# Altium project TIDA-010933-RevA.PrjPcb (part 6 of 8)
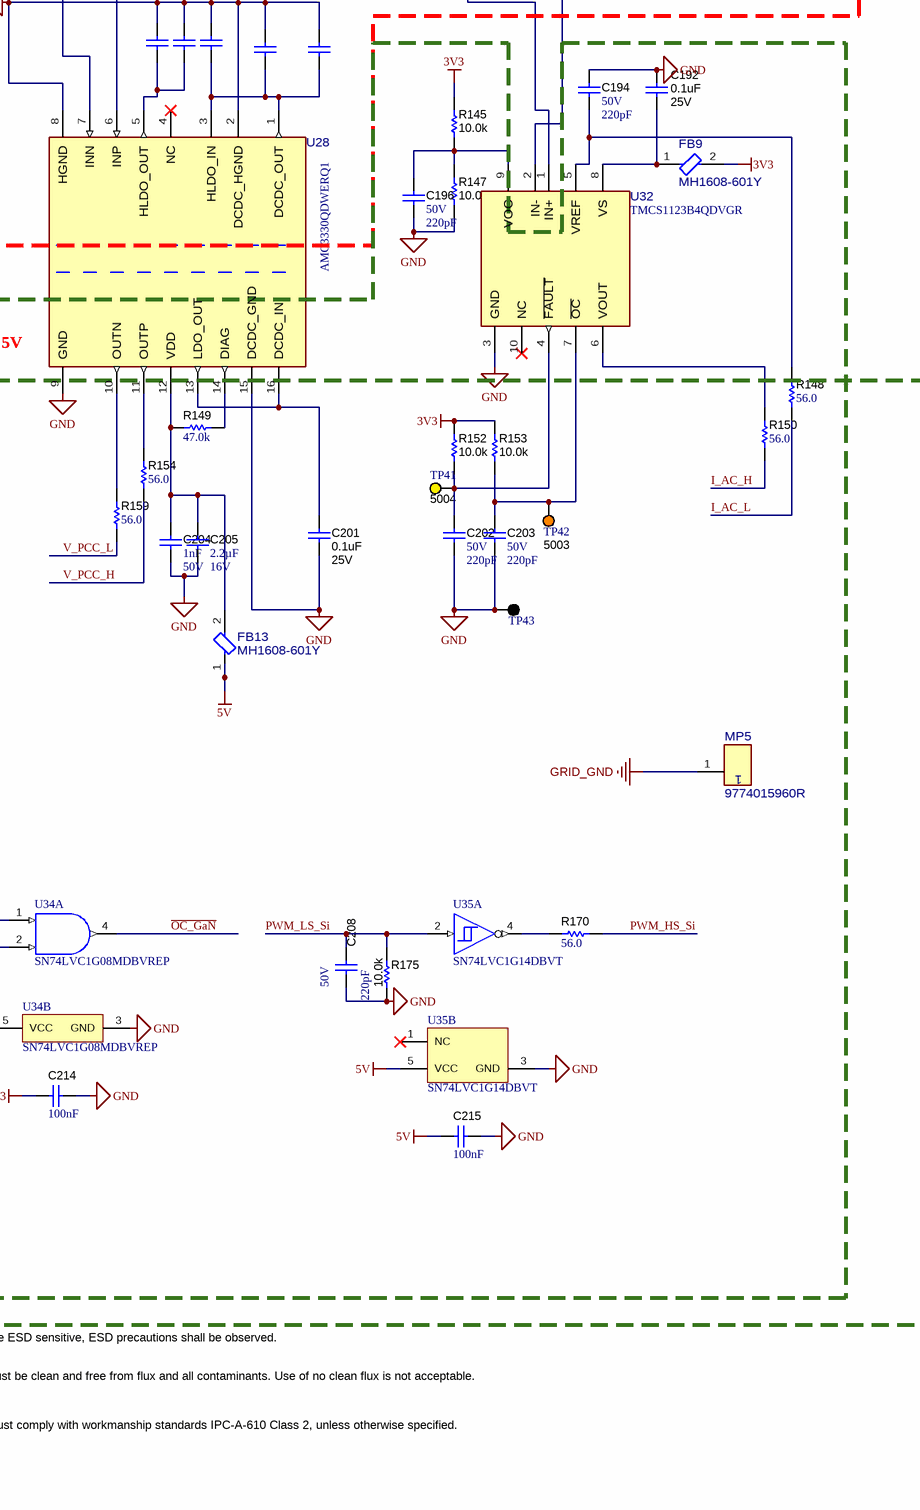
[diagram p111: TIDA-010933-DCAC-TOP.SchDoc, bottom right]

## Sheet TIDA-010933-DCAC-TOP.SchDoc (continued)

### Library data of the parts
!PCB1 = CMP-0003618-2: Manufacturer: Any; PartNumber: TIDA-010933; CompType: PCB; RoHS: O; MountType: N/A; Publisher: Texas Instruments; LatestRevisionDate: 2017-03-09; Key: PCB
C167-C170 = CMP-0009613-2: CAP, CERM, 2200 pF, 300 V, +/- 20%, E, TH, 2- Leads, Body 9x7mm, Pin Spacing 7.5mm; Manufacturer: MuRata; TaMin_C: -40°C; Polarized: N; SizeAreaWB_mm2: 99; Value1: Unknown; U/M: EA; Value: 2200pF; TaMax_C: 125°C; SizeZ_mm: 12; SizeX_mm: 9; SizeY_mm: 7; Cap_Case: 9x7x9mm; SizeArea_mm2: 63; Cap_F: 2.2nF; AEC Category: Q200; Supplier Part Number 2: 81-DE6E3KJ222MN3A; Publisher: Texas Instruments; Supplier 2: Mouser; TempCo: E; Published: 2008-06-19; RoHS: Y; MountType: TH; Supplier 1: Digi-Key; PackageReference: TH, 2- Leads, Body 9x7mm, Pin Spacing 7.5mm; Tolerance_%: 20%; Value2: 300V; CompType: Capacitor; LatestRevisionDate: 2017-03-09; PartNumber: DE6E3KJ222MN3A; AEC Qualified: ?; ComponentLink1Description: Datasheet link; Supplier Part Number 1: DE6E3KJ222MN3A-ND; Technology: Ceramic; ComponentLink1URL: http://psearch.murata.com/capacitor/product/DE6E3KJ222MN3A.pdf
C171 C172 = CMP-0094225-1: 5.6 µF Film Capacitor - 600V Polypropylene (PP), Metallized Radial; Manufacturer: KEMET; Standoff Height: 0.5mm; SizeZ_mm: 25.2mm; AEC Qualified: Yes; Cap_F: 5.6µF; Tolerance_%: 5%; AEC Grade: Grade 1; Value: 5.6µF; Lead Free: Yes; Datasheet Path: datasheets/Cap-C4AQHBU4560P1XJ.pdf; ComponentLink1URL: https://content.kemet.com/datasheets/KEM_F3128_C4AQ_P.pdf; PartNumber: C4AQHBU4560P1XJ; Digikey Description: CAP FILM 5.6UF 5% 600VDC RADIAL; Supplier 1: Digikey; Supplier Part Number 1: 399-C4AQHBU4560P1XJ-ND; datasheet: https://content.kemet.com/datasheets/KEM_F3128_C4AQ_P.pdf; Part Number: C4AQHBU4560P1XJ; helpURL: https://upverter.com/upn/revision/c563b483adbcab9e/; PackageReference: RADIAL; ComponentLink1Description: Datasheet; Supplier 2: Mouser; Mouser Part Number: 80-C4AQHBU4560P1XJ; Operating Temperature Range: -55°C to +125°C; Supplier Part Number 2: 80-C4AQHBU4560P1XJ; Digikey Part Number: 399-C4AQHBU4560P1XJ-ND; RoHS: TRUE
C173 C175 C179 = CMP-0038374-1: ALC80, Aluminum Electrolytic, 120 uF, 20%, 450 VDC, -40/+105°C; Manufacturer: KEMET; AEC Qualified: No; Cap_F: 120µF; IRMS_A: 3.13A; SizeZ_mm: 42mm; Esr: 1.075; Leakage Current: 162uA; Life: 6000Hours; Value: 120µF; PackageReference: RADIAL; PartNumber: ALC80A121BD450; RoHS: TRUE; Tolerance_%: 20%; Part Number: ALC80A121BD450; datasheet: https://content.kemet.com/datasheets/KEM_A4082_ALC80.pdf; Datasheet Path: datasheets/Cap-ALC80A121BD450.pdf; helpURL: https://upverter.com/upn/revision/7d670a938a867c59/; Lead Free: Yes; Operating Temperature Range: -40°C to +105°C; ComponentLink1Description: Datasheet; ComponentLink1URL: https://content.kemet.com/datasheets/KEM_A4082_ALC80.pdf
C174 C178 C180 C181 = CMP-0009326-2: CAP, CERM, 0.1 uF, 1000 V, +/- 10%, X7R, 1812; Manufacturer: Kemet; Polarized: N; Value: 0.1uF; U/M: EA; Cap_F: 100nF; Value1: Unknown; VDC_V: 1kV; Value2: 1000V; TaMin_C: -55°C; TaMax_C: 125°C; Cap_Case: 1812; AEC Category: Q200; SizeArea_mm2: 14.4; SizeAreaWB_mm2: 23.1; SizeX_mm: 4.5; SizeY_mm: 3.2; SizeZ_mm: 2.54; CompType: Capacitor; PartNumber: C1812W104KDRACTU; PackageReference: 1812; RoHS: Y; Tolerance_%: 10%; MountType: SMT; Technology: Ceramic; TempCo: X7R; Published: 2008-06-19; Publisher: Texas Instruments; LatestRevisionDate: 2017-03-09; ComponentLink1Description: Datasheet link; ComponentLink1URL: http://www.kemet.com/Lists/ProductCatalog/Attachments/122/KEM_C1034_X7R_HV_ARC_SMD.pdf; Supplier 1: Digi-Key; Supplier Part Number 1: 399-6523-1-ND; Supplier 2: Newark; Supplier Part Number 2: 93T1500; Supplier 3: Mouser; Supplier Part Number 3: 80-C1812W104KDR; AEC Qualified: N; AEC Grade: N/A
C176 = CMP-0037952-1: 2.2 µF Film Capacitor 310V Polypropylene (PP), Metallized Radial; Manufacturer: KEMET; AEC Grade: Grade 2; AEC Qualified: Yes; Cap_F: 2.2µF; SizeZ_mm: 25.1mm; Tolerance_%: 10%; VAC_X: X2; Value: 2.2µF; PackageReference: RADIAL; PartNumber: F863FL225K310Z; RoHS: TRUE; Supplier 1: Digikey; Supplier 2: Mouser; Supplier Part Number 1: 399-14811-ND; Supplier Part Number 2: 80-F863FL225K310Z; VAC: 310V; Part Number: F863FL225K310Z; datasheet: https://content.kemet.com/datasheets/KEM_F3110_F863_X2_310.pdf; Datasheet Path: datasheets/Cap-F863FL225K310Z.pdf; Digikey Description: CAP FILM 2.2UF 10% 310VAC RADIAL; Digikey Part Number: 399-14811-ND; helpURL: https://upverter.com/upn/revision/6037da2ac259c91a/; Lead Free: Yes; Mouser Part Number: 80-F863FL225K310Z; Operating Temperature Range: -40°C to +110°C; Voltage Ac Rating X: 310V; ComponentLink1Description: Datasheet; ComponentLink1URL: https://content.kemet.com/datasheets/KEM_F3110_F863_X2_310.pdf
C177 = CMP-0037951-1: Cap Film 1uF 310VAC PP 10% (26.5 X 11 X 20mm) Dipped Radial 22.5mm 110°C Pizza Pack; Manufacturer: KEMET; AEC Grade: Grade 1; AEC Qualified: Yes; Cap_F: 1µF; SizeZ_mm: 20.1mm; VAC: 310V; VAC_X: X2; Value: 1µF; PackageReference: RADIAL; PartNumber: F863DS105K310Z; RoHS: TRUE; Supplier 1: Digikey; Supplier 2: Mouser; Supplier Part Number 1: 399-14809-ND; Supplier Part Number 2: 80-F863DS105K310Z; Tolerance_%: 10%; Part Number: F863DS105K310Z; datasheet: https://content.kemet.com/datasheets/KEM_F3110_F863_X2_310.pdf; Datasheet Path: datasheets/Cap-F863DS105K310Z.pdf; Digikey Description: CAP FILM 1UF 10% 310VAC RADIAL; Digikey Part Number: 399-14809-ND; helpURL: https://upverter.com/upn/revision/10eff80190826337/; Lead Free: Yes; Mouser Part Number: 80-F863DS105K310Z; Operating Temperature Range: -40°C to +110°C; Voltage Ac Rating X: 310V; ComponentLink1Description: Datasheet; ComponentLink1URL: https://content.kemet.com/datasheets/KEM_F3110_F863_X2_310.pdf
C182 C184 = CMP-0007238-4: CAP, CERM, 1000 pF, 100 V, +/- 5%, C0G/NP0, 0603; Manufacturer: MuRata; TaMin_C: -55°C; Polarized: N; SizeAreaWB_mm2: 4.68; Value1: Unknown; U/M: EA; Value: 1000pF; TaMax_C: 125°C; SizeZ_mm: 1; SizeX_mm: 1.6; SizeY_mm: 0.8; SizeArea_mm2: 1.28; Cap_F: 1nF; AEC Category: Q200; Supplier Part Number 2: 81-GRM1885C2A102JA01; Publisher: Texas Instruments; Supplier 2: Mouser; TempCo: C0G/NP0; Published: 2008-06-19; RoHS: Y; MountType: SMT; Supplier 1: Digi-Key; PackageReference: 0603; Tolerance_%: 5%; Cap_Case: 0603; Value2: 100V; CompType: Capacitor; LatestRevisionDate: 2017-03-09; PartNumber: GRM1885C2A102JA01D; AEC Qualified: ?; ComponentLink1Description: Datasheet link; Supplier Part Number 1: 490-3281-1-ND; Technology: Ceramic; ComponentLink1URL: http://search.murata.co.jp/Ceramy/PnsearchViewAction.do?HnOFG=ON&HnNFG=ON&SEL_CNT=50&sLang=en&sKey=GRM1885C2A102JA01D&x=9&y=9&search=startwith
C183 C190 = CMP-0007082-4: CAP, CERM, 0.01 uF, 100 V, +/- 10%, X7R, AEC-Q200 Grade 1, 0603; Manufacturer: TDK; TaMin_C: -55°C; ESR_ohm: 2.35428d; Polarized: N; SizeAreaWB_mm2: 4.68; Value1: 0.235428 ohm; U/M: EA; Value: 0.01uF; TaMax_C: 125°C; SizeZ_mm: 1; SizeX_mm: 1.6; SizeY_mm: 0.8; SizeArea_mm2: 1.28; AEC Qualified: Y; IRMS_A: 3.96995dA; AEC Category: Q200; Supplier Part Number 2: 810-CGA3E2X7R2A103K080AA; Publisher: Texas Instruments; Supplier 2: Mouser; TempCo: X7R; Published: 2008-06-19; RoHS: Y; MountType: SMT; Supplier 1: Digi-Key; PackageReference: 0603; Tolerance_%: 10%; Cap_Case: 0603; Value2: 100V; CompType: Capacitor; LatestRevisionDate: 2017-03-09; PartNumber: CGA3E2X7R2A103K080AA; ComponentLink1Description: Datasheet link; AEC Grade: 1; Supplier Part Number 1: 445-5812-1-ND; Technology: Ceramic; ValueDisplayed: 0.01uF; ComponentLink1URL: https://product.tdk.com/en/search/capacitor/ceramic/mlcc/info?part_no=CGA3E2X7R2A103K080AA
C185 C188 C204 = CMP-0006976-1: CAP, CERM, 1000 pF, 50 V, +/- 10%, X7R, 0603; Manufacturer: Kemet; TaMin_C: -55°C; Polarized: N; SizeAreaWB_mm2: 4.68; Value1: Unknown; U/M: EA; Value: 1000pF; TaMax_C: 125°C; SizeZ_mm: 1; SizeX_mm: 1.6; SizeY_mm: 0.8; SizeArea_mm2: 1.28; AEC Category: Q200; ComponentLink1URL: http://www.kemet.com/kemet/web/homepage/kechome.nsf/vapubfiles/F3102_Y5V.pdf/$file/F3102_Y5V.pdf; Supplier Part Number 2: 80-C0603X102K5R; Publisher: Texas Instruments; Supplier 2: Mouser; Supplier Part Number 3: 1414025; TempCo: X7R; Supplier 3: Farnell; Published: 2008-06-19; RoHS: Y; MountType: SMT; Supplier 1: Digi-Key; PackageReference: 0603; Tolerance_%: 10%; Cap_Case: 0603; Value2: 50V; CompType: Capacitor; LatestRevisionDate: 2017-03-09; PartNumber: C0603X102K5RACTU; AEC Qualified: ?; ComponentLink1Description: Datasheet link; Supplier Part Number 1: 399-5348-1-ND; Technology: Ceramic; ValueDisplayed: 1000pF
C186 C187 C192 C201 = CMP-0006979-5: CAP, CERM, 0.1 uF, 25 V, +/- 10%, X7R, 0603; Manufacturer: Kemet; Polarized: N; Value: 0.1uF; U/M: EA; Cap_F: 100nF; Value1: Unknown; TaMin_C: -55°C; TaMax_C: 125°C; AEC Category: Q200; SizeArea_mm2: 1.28; SizeAreaWB_mm2: 4.68; SizeX_mm: 1.6; SizeY_mm: 0.8; SizeZ_mm: 1; CompType: Capacitor; PartNumber: C0603X104K3RACTU; PackageReference: 0603; RoHS: Y; Tolerance_%: 10%; Value2: 25V; MountType: SMT; Technology: Ceramic; TempCo: X7R; Cap_Case: 0603; Published: 2008-06-19; Publisher: Texas Instruments; LatestRevisionDate: 2017-03-09; ComponentLink1Description: Datasheet link; ComponentLink1URL: http://www.kemet.com/kemet/web/homepage/kechome.nsf/vapubfiles/F3102_Y5V.pdf/$file/F3102_Y5V.pdf; Supplier 1: Digi-Key; Supplier Part Number 1: 399-5345-1-ND; Supplier 2: Mouser; Supplier Part Number 2: 80-C0603X104K3R; Supplier 3: Farnell; Supplier Part Number 3: 1601773; AEC Qualified: ?
C189 C205 = CMP-0007121-4: CAP, CERM, 2.2 uF, 16 V, +/- 10%, X7R, 0603; Manufacturer: Taiyo Yuden; TaMin_C: -55°C; Polarized: N; SizeAreaWB_mm2: 4.68; Value1: Unknown; U/M: EA; Value: 2.2uF; TaMax_C: 125°C; SizeZ_mm: 1; SizeX_mm: 1.6; SizeY_mm: 0.8; SizeArea_mm2: 1.28; AEC Category: Q200; Supplier Part Number 2: 68X1300; Publisher: Texas Instruments; Supplier 2: Newark; Supplier Part Number 3: 963-EMK107BB7225KA-T; TempCo: X7R; Supplier 3: Mouser; Published: 2008-06-19; RoHS: Y; MountType: SMT; Supplier 1: Digi-Key; PackageReference: 0603; Tolerance_%: 10%; Cap_Case: 0603; Value2: 16V; CompType: Capacitor; LatestRevisionDate: 2017-03-09; PartNumber: EMK107BB7225KA-T; AEC Qualified: N; ComponentLink1Description: Datasheet link; AEC Grade: N/A; Supplier Part Number 1: EMK107BB7225KA-T-ND; Technology: Ceramic; ValueDisplayed: 2.2uF; ComponentLink1URL: http://www.yuden.co.jp/productdata/catalog/en/mlcc_all_e.pdf
C191 C193 C195 C197-C199 C206 C213-C215 = CMP-0006752-5: CAP, CERM, 0.1 uF, 25 V, +/- 5%, X7R, 0603; Manufacturer: AVX; TaMin_C: -55°C; ESR_ohm: 0.05; Polarized: N; SizeAreaWB_mm2: 4.68; Value1: 0.05 ohm; U/M: EA; Value: 0.1uF; TaMax_C: 125°C; SizeZ_mm: 1; SizeX_mm: 1.6; SizeY_mm: 0.8; Value2: 25V; SizeArea_mm2: 1.28; AEC Category: Q200; Supplier Part Number 2: 581-06033C104JAT2A; Publisher: Texas Instruments; Supplier 2: Mouser; Supplier Part Number 3: 1740614; TempCo: X7R; Supplier 3: Farnell; Published: 2008-06-19; RoHS: Y; MountType: SMT; Supplier 1: Digi-Key; PackageReference: 0603; Tolerance_%: 5%; Cap_Case: 0603; CompType: Capacitor; LatestRevisionDate: 2017-03-09; PartNumber: 06033C104JAT2A; AEC Qualified: N; VDC_V: 25V; ComponentLink1Description: Datasheet link; AEC Grade: N/A; Supplier Part Number 1: 478-3713-1-ND; Technology: Ceramic; ValueDisplayed: 0.1uF; ComponentLink1URL: http://datasheets.avx.com/X7RDielectric.pdf
C194 C196 C202 C203 C208-C212 C216 C217 = CMP-0006894-4: CAP, CERM, 220 pF, 50 V, +/- 10%, C0G/NP0, 0603; Manufacturer: Kemet; TaMin_C: -55°C; Polarized: N; SizeAreaWB_mm2: 4.68; Value1: Unknown; U/M: EA; Value: 220pF; TaMax_C: 125°C; SizeZ_mm: 1; SizeX_mm: 1.6; SizeY_mm: 0.8; SizeArea_mm2: 1.28; AEC Category: Q200; Supplier Part Number 2: 80-C0603C221K5G; Publisher: Texas Instruments; Supplier 2: Mouser; Supplier Part Number 3: 1167797; TempCo: C0G/NP0; Supplier 3: Farnell; Published: 2008-06-19; RoHS: Y; MountType: SMT; Supplier 1: Digi-Key; PackageReference: 0603; Tolerance_%: 10%; Cap_Case: 0603; Value2: 50V; CompType: Capacitor; LatestRevisionDate: 2017-03-09; PartNumber: C0603C221K5GACTU; AEC Qualified: ?; Cap_F: 220pF; ComponentLink1Description: Datasheet link; Supplier Part Number 1: 399-1065-1-ND; Technology: Ceramic; ComponentLink1URL: http://www.kemet.com/kemet/web/homepage/kechome.nsf/vapubfiles/F3102_Y5V.pdf/$file/F3102_Y5V.pdf
C200 = CMP-0006844-4: CAP, CERM, 1000 pF, 50 V, +/- 5%, X7R, AEC-Q200 Grade 1, 0603; Manufacturer: Kemet; TaMin_C: -55°C; Polarized: N; SizeAreaWB_mm2: 4.68; Value1: Unknown; U/M: EA; Value: 1000pF; TaMax_C: 125°C; SizeZ_mm: 1; SizeX_mm: 1.6; SizeY_mm: 0.8; SizeArea_mm2: 1.28; AEC Qualified: Y; AEC Category: Q200; Publisher: Texas Instruments; Supplier 2: Newark; Supplier Part Number 3: 80-C0603C102J5RAUTO; TempCo: X7R; Supplier 3: Mouser; Published: 2008-06-19; RoHS: Y; MountType: SMT; Supplier 1: Digi-Key; PackageReference: 0603; Tolerance_%: 5%; Cap_Case: 0603; Value2: 50V; CompType: Capacitor; LatestRevisionDate: 2017-03-09; PartNumber: C0603C102J5RACAUTO; ComponentLink1Description: Datasheet link; AEC Grade: 1; Supplier Part Number 1: 399-12989-1-ND; Technology: Ceramic; ValueDisplayed: 1000pF; ComponentLink1URL: http://www.kemet.com/docfinder?Partnumber=C0603C102J5RACAUTO
C207 = CMP-0011981-2: CAP, TA, 470 uF, 10 V, +/- 20%, 0.045 ohm, SMD; Manufacturer: AVX; TaMin_C: -55°C; ESR_ohm: 0.045; Polarized: Y; SizeAreaWB_mm2: 58.59; U/M: EA; Value: 470uF; TaMax_C: 125°C; SizeZ_mm: 4.3; SizeX_mm: 7.3; Cap_Case: E; SizeArea_mm2: 31.39; CompType: Capacitor; Cap_F: 470µF; IRMS_A: 1.732A; AEC Category: Q200; Supplier Part Number 2: 75M2993; Publisher: Texas Instruments; Supplier 2: Newark; Supplier Part Number 3: 581-TPSE477M010R0045; Supplier 3: Mouser; RoHS: Y; Value1: 0.045 ohm; MountType: SMT; Supplier 1: Digi-Key; LatestRevisionNote: Updated supplier links; PackageReference: 7343-43; Tolerance_%: 20%; SizeY_mm: 4.3; Value2: 10V; LatestRevisionDate: 2017-03-09; PartNumber: TPSE477M010R0045; AEC Qualified: ?; Series: TPS; ComponentLink1Description: Datasheet link; Supplier Part Number 1: 478-4148-1-ND; Technology: TA; ComponentLink1URL: http://www.avx.com/docs/masterpubs/tantniob.pdf
C220 C221 = CMP-0007196-3: CAP, CERM, 22 pF, 50 V, +/- 5%, C0G/NP0, 0603; Manufacturer: MuRata; TaMin_C: -55°C; Polarized: N; SizeAreaWB_mm2: 4.68; Value1: Unknown; U/M: EA; Value: 22pF; TaMax_C: 125°C; SizeZ_mm: 1; SizeX_mm: 1.6; SizeY_mm: 0.8; Value2: 50V; SizeArea_mm2: 1.28; AEC Category: Q200; Supplier Part Number 2: 81-GRM39C220J50; Publisher: Texas Instruments; Supplier 2: Mouser; Supplier Part Number 3: 8819831; TempCo: C0G/NP0; Supplier 3: Farnell; Published: 2008-06-19; RoHS: Y; MountType: SMT; Supplier 1: Digi-Key; PackageReference: 0603; Tolerance_%: 5%; Cap_Case: 0603; CompType: Capacitor; LatestRevisionDate: 2017-03-09; PartNumber: GRM1885C1H220JA01D; AEC Qualified: ?; Cap_F: 22pF; VDC_V: 50V; ComponentLink1Description: Datasheet link; Supplier Part Number 1: 490-1411-1-ND; Technology: Ceramic; ComponentLink1URL: http://search.murata.co.jp/Ceramy/PnsearchViewAction.do?HnOFG=ON&HnNFG=ON&SEL_CNT=50&sLang=en&sKey=GRM1885C1H220JA01D&x=9&y=9&search=startwith
D32 = CMP-0028882-2: Diode, Schottky, 40 V, 0.75 A, AEC-Q101, SOD-323; Manufacturer: Infineon Technologies; SizeAreaWB_mm2: 8.695; SizeX_mm: 2.7; Value1: 0.75A; Value2: 0.74V; SizeArea_mm2: 3.645; Vr_V: 40V; SizeY_mm: 1.35; Io_A: 750mA; Green_REACh: Incomplete; Value: 40V; Vf_V: 740mV; AEC Qualified: Y; SizeZ_mm: 1; Green_Lifecycle: Not Set; AEC Category: Q101; TJmax_C: 150°C; RoHS: Y; ComponentLink1URL: http://www.infineon.com/dgdl/bat165series.pdf?folderId=db3a304313d846880113def5812204a1&fileId=db3a304313d846880113df01f69804d6; ComponentLink1Description: Datasheet link; Green_EU RoHS: Incomplete; Green_EU RoHS-2: Incomplete; Type: Schottky; CompType: Diode; MountType: SMT; PartNumber: BAT165E6327HTSA1; PackageReference: SOD-323
F1 F2 = CMP-0037653-1: 15 A 250 V AC 80 V DC Fuse Board Mount (Cartridge Style Excluded) Surface Mount 2-SMD, Square End Block; Manufacturer: Bourns; Interrupt_AC: 150A; Interrupt_DC: 300A; MeltingTyp: 141.75A2Sec; SizeZ_mm: 3.3mm; VAC_V: 250V; Fuse Speed: Fast; AEC Qualified: No; Fuse Current: 15A; Res_ohm: 0.005Ω; PackageReference: 3812; PartNumber: SF-3812F1500T-2; RoHS: TRUE; Supplier 1: Digikey; Supplier 2: Mouser; Supplier Part Number 1: SF-3812F1500T-2CT-ND; Supplier Part Number 2: 652-SF-3812F1500T-2; Part Number: SF-3812F1500T-2; datasheet: https://www.bourns.com/docs/Product-Datasheets/SF-3812F-T.pdf; Datasheet Path: datasheets/Fuse-SF-3812F1500T-2.pdf; Digikey Description: FUSE BRD MT 15A 250VAC/80DC 2SMD; Digikey Part Number: SF-3812F1500T-2CT-ND; Fuse I2T: 141.75A2Sec; Fuse Interrupt Dc Current: 300A; helpURL: https://upverter.com/upn/revision/1547e1d885071418/; Lead Free: Yes; Mouser Description: Fuse Chip Fast Acting 15A 250V SMD Solder Pad 3812 10.1 X 3.1mm Ceramic T/R; Mouser Part Number: 652-SF-3812F1500T-2; Operating Temperature Range: -55°C to +125°C; ComponentLink1Description: Datasheet; ComponentLink1URL: https://www.bourns.com/docs/Product-Datasheets/SF-3812F-T.pdf
FB6-FB13 = CMP-0037505-1: 600 Ohms @ 100 MHz 1 Power, Signal Line Ferrite Bead 0603 (1608 Metric) 1A 200mOhm; Manufacturer: Bourns; DCR_ohm: 0.2; SizeZ_mm: 1mm; AEC Qualified: No; Impedance At Frequency: 600Ω @ 100MHz; Test Frequency: 100MHz; Tolerance_%: 25%; Imax_A: 1A; PackageReference: 0603; PartNumber: MH1608-601Y; RoHS: TRUE; Supplier 1: Digikey; Supplier 2: Mouser; Supplier Part Number 1: MH1608-601YCT-ND; Supplier Part Number 2: 652-MH1608-601Y; Part Number: MH1608-601Y; datasheet: https://www.bourns.com/docs/Product-Datasheets/mh.pdf; Datasheet Path: datasheets/FBead-MH1608-601Y.pdf; Digikey Description: FERRITE BEAD 600 OHM 0603 1LN; Digikey Part Number: MH1608-601YCT-ND; helpURL: https://upverter.com/upn/revision/07c7dad827ccdff3/; Lead Free: Yes; Material: Ferrite; Mouser Description: Ferrite Beads 600 ohms 25% HIGH CURRENT; Mouser Part Number: 652-MH1608-601Y; Operating Temperature Range: -55°C to +125°C; Technology: Chip; ComponentLink1Description: Datasheet; ComponentLink1URL: https://www.bourns.com/docs/Product-Datasheets/mh.pdf
FID1-FID6 = CMP-0077181-1: Fiducial mark.  There is nothing to buy or mount.; CompType: Fiducial; Manufacturer: N/A; MountType: N/A; PackageReference: N/A; PartNumber: N/A; ClassName: FiducialMark; Library Reference: Fiducial
J9 = CMP-0094328-1: 3 Position Terminal Block Header, Male Pins, Shrouded (4 Side) 0.200" (5.08mm) Vertical - Through Hole; Manufacturer: TE Connectivity; Current_A: 15A; Row_Count: 1; AEC Qualified: No; Voltage_V: 300V; SizeZ_mm: 12.25mm; Min Wire Gauge: 30; ContactFinish: Tin; Max Wire Gauge: 12; Supplier Part Number 2: 571-796636-3; datasheet: https://www.te.com/commerce/DocumentDelivery/DDEController?Action=showdoc&DocId=Customer+Drawing%7F796636%7FC6%7Fpdf%7FEnglish%7FENG_CD_796636_C6.pdf%7F796636-3; Datasheet Path: datasheets/Conn-796636-3.pdf; PartNumber: 796636-3; ComponentLink1URL: https://www.te.com/commerce/DocumentDelivery/DDEController?Action=showdoc&DocId=Customer+Drawing%7F796636%7FC6%7Fpdf%7FEnglish%7FENG_CD_796636_C6.pdf%7F796636-3; Lead Free: Yes; ComponentLink1Description: Datasheet; Supplier 1: Digikey; Operating Temperature Range: -40°C to +105°C; helpURL: https://upverter.com/upn/revision/c1a9aec1f58481f7/; Digikey Description: TERM BLOCK HDR 3POS VERT 5.08MM; Supplier Part Number 1: A98423-ND; RoHS: TRUE; Mouser Description: Buchanan, Terminal Block Connector, PCB, Header, Single Row, 3 Position, 5.08 mm, Green; PinCount: 3; Part Number: 796636-3; Digikey Part Number: A98423-ND; Conn Orientation: Vertical; Conn Gender: Male; PackageReference: HDR3; Mouser Part Number: 571-796636-3; DUT-Pitch_mm: 5.08mm; Supplier 2: Mouser
J16 = CMP-0032022-2: Banana Jack Connector Standard Banana Solder Red; Manufacturer: CLIFF Electronic Components; ContactFinish: Gold; Current_A: 24A; Voltage_V: 1kV; AEC Qualified: No; Conn Orientation: Horizontal; Is Female: yes; SizeZ_mm: 12.5mm; Standoff Height: 0.7mm; PackageReference: CONN_BANANA_JACK; PartNumber: FCR7350R; PinCount: 1; RoHS: TRUE; Supplier 1: Digikey; Supplier Part Number 1: 4654-FCR7350R-ND; Part Number: FCR7350R; datasheet: https://www.farnell.com/datasheets/3216443.pdf; Datasheet Path: datasheets/Conn-FCR7350R.pdf; Digikey Description: 4MM PANEL SKT S16N-PC RED; Digikey Part Number: 4654-FCR7350R-ND; helpURL: https://upverter.com/upn/revision/ed2a00f5535e7036/; Lead Free: Yes; Operating Temperature Range: -40°C to +80°C; ComponentLink1Description: Datasheet; ComponentLink1URL: https://www.farnell.com/datasheets/3216443.pdf
J17 J19 = CMP-0032021-2: Banana Jack Connector Standard Banana Solder Black; Manufacturer: CLIFF Electronic Components; ContactFinish: Gold; Current_A: 24A; Voltage_V: 1kV; AEC Qualified: No; Conn Orientation: Horizontal; Is Female: yes; SizeZ_mm: 12.5mm; Standoff Height: 0.7mm; PackageReference: CONN_BANANA_JACK; PartNumber: FCR7350B; PinCount: 1; RoHS: TRUE; Supplier 1: Digikey; Supplier Part Number 1: 4654-FCR7350B-ND; Part Number: FCR7350B; datasheet: https://www.cliffuk.co.uk/products/testleads/sockets/fcr7350.pdf; Datasheet Path: datasheets/Conn-FCR7350B.pdf; Digikey Description: 4MM PANEL SKT S16N-PC BLACK; Digikey Part Number: 4654-FCR7350B-ND; helpURL: https://upverter.com/upn/revision/598fb79d4513ed1f/; Lead Free: Yes; Operating Temperature Range: -40°C to +80°C; ComponentLink1Description: Datasheet; ComponentLink1URL: https://www.cliffuk.co.uk/products/testleads/sockets/fcr7350.pdf
J18 = CMP-0032023-2: Banana Jack Connector Standard Banana Solder Yellow; Manufacturer: CLIFF Electronic Components; ContactFinish: Gold; Current_A: 24A; Voltage_V: 1kV; AEC Qualified: No; Conn Orientation: Horizontal; Is Female: yes; SizeZ_mm: 12.5mm; Standoff Height: 0.7mm; PackageReference: CONN_BANANA_JACK; PartNumber: FCR7350Y; PinCount: 1; RoHS: TRUE; Supplier 1: Digikey; Supplier Part Number 1: 4654-FCR7350Y-ND; Part Number: FCR7350Y; datasheet: https://www.farnell.com/datasheets/3216443.pdf; Datasheet Path: datasheets/Conn-FCR7350Y.pdf; Digikey Description: 4MM PANEL SKT S16N-PC YELLOW; Digikey Part Number: 4654-FCR7350Y-ND; helpURL: https://upverter.com/upn/revision/477f41296692cbd3/; Lead Free: Yes; Operating Temperature Range: -40°C to +80°C; ComponentLink1Description: Datasheet; ComponentLink1URL: https://www.farnell.com/datasheets/3216443.pdf
J20 = CMP-0098295-2: Banana Test Connector, 4mm, Socket, PCB Mount, 24 A, 1 kV, Gold Plated Contacts, Blue; Manufacturer: CLIFF Electronic Components; Current_A: 24A; Voltage_V: 1kV; AEC Qualified: No; Conn Orientation: Right Angle; SizeZ_mm: 11.6mm; Standoff Height: 0.7mm; ContactFinish: Gold; PackageReference: CONN_BANANA_JACK; PartNumber: FCR7350L; PinCount: 1; RoHS: TRUE; Part Number: FCR7350L; datasheet: https://www.cliffuk.co.uk/products/testleads/sockets/fcr7350.pdf; Datasheet Path: datasheets/Conn-FCR7350L.pdf; helpURL: https://upverter.com/upn/revision/8f9f2a5472dd5be9/; Lead Free: Yes; Operating Temperature Range: -40°C to +80°C; ComponentLink1Description: Datasheet; ComponentLink1URL: https://www.cliffuk.co.uk/products/testleads/sockets/fcr7350.pdf
K1 = CMP-0002638-2: Relay, SPDT (1 Form C), 16 A, 5 V, TH; Manufacturer: TE Connectivity; Contact Rating_A: 16A; Turn On Voltage (Max)_VDC: 3.5V; Coil Power_W: 403mW; Coil Resistance_ohm: 62; SizeAreaWB_mm2: 455.7; Time Operate (s): 8ms; Coil Current_A: 80.6mA; SizeZ_mm: 15.7; SizeX_mm: 12.7; SizeY_mm: 29; SizeArea_mm2: 368.3; Turn Off Voltage (Min)_VDC: 5dV; Coil Type: Non Latching; Time Release (s): 6ms; Coil Voltage_VDC: 5V; Supplier Part Number 2: 36K7603; Supplier 2: Newark; Supplier Part Number 3: 655-RTD14005F; Supplier 3: Mouser; RoHS: Y; MountType: TH; Supplier 1: Digi-Key; Contact Form: SPDT (1 Form C); PackageReference: 29 x 12.7 mm; PartNumber: RTD14005F; ComponentLink1Description: Datasheet URL; Supplier Part Number 1: PB291-ND; ComponentLink1URL: http://www.te.com/commerce/DocumentDelivery/DDEController?Action=srchrtrv&DocNm=RT1pb&DocType=DS&DocLang=English
L8 = CMP-0042321-1: PFC Inductor; Manufacturer: Bourns; Part Number: D6746; AEC Qualified: No; Ind_H: 200µH; Irms: 7A; SizeZ_mm: 25mm; Value: 200uH; Test Frequency: 120kHz; Tolerance_%: 10%; PackageReference: PTH_59MM5_50MM0; PartNumber: 145450; RoHS: TRUE; Technology: Wirewound; Datasheet Path: datasheets/Ind-D6746.pdf; helpURL: https://upverter.com/upn/revision/b4f5dbfb28e8d931/; Lead Free: Yes; Operating Temperature Range: -40°C to +125°C
L9 L10 = CMP-0042320-3: Common Mode Chokes 4mH 50mohm 250kHz; Manufacturer: Bourns; Part Number: D6744; AEC Qualified: No; DCR_ohm: 50m; SizeZ_mm: 24mm; Ind_H: 4mH; PackageReference: PTH_CMC_38MM0; PartNumber: 047690; RoHS: TRUE; Technology: Wirewound; Datasheet Path: datasheets/Ind-D6744.pdf; helpURL: https://upverter.com/upn/revision/f5ce77b0b37f7489/; Lead Free: Yes; Operating Temperature Range: -40°C to +125°C; Test Frequency: 250kHz
L11 = CMP-0058159-1: Inductor, Wirewound, Ferrite, 0.3 A, 0.45 ohm, SMD; Manufacturer: Bourns; Green_Lifecycle: NRND; SizeAreaWB_mm2: 6.6; DCR_ohm: 4.5d; Green_REACh: Passed; Imax_A: 3dA; SizeZ_mm: 1.4; SizeX_mm: 2; SizeY_mm: 1.2; Value2: 0.3A; SizeArea_mm2: 2.4; AEC Category: Q200; ComponentLink1URL: http://www.bourns.com/data/global/pdfs/SRF2012A.pdf; Supplier Part Number 2: 54W0024; Publisher: Texas Instruments; Supplier 2: Newark; Supplier Part Number 3: 652-SRF2012-361YA; Supplier 3: Mouser; Published: 2008-06-26; RoHS: Y; Value1: 0.45 ohm; Material: Ferrite; MountType: SMT; Green_EU RoHS-2: Incomplete; Supplier 1: Digi-Key; Green_EU RoHS: Passed; PackageReference: 2.0x1.2x1.2mm; CompType: Inductor; LatestRevisionDate: 2017-06-02; PartNumber: SRF2012-361YA; AEC Qualified: ?; ComponentLink1Description: Datasheet link; Supplier Part Number 1: SRF2012-361YACT-ND; Technology: Wirewound
Logo1 = CMP-0074847-1: FCC_disclaimer; Library Reference: Logo; Published: 2009-03-03; Publisher: Texas Instruments; LatestRevisionDate: 2017-07-06; Lib Reference: FCC_disclaimer; PartNumber: FCC disclaimer
Logo2 = CMP-0074769-1: Library Reference: WEEE logo; Lib Reference: WEEE logo; PartNumber: WEEE logo
LOGO3 = CMP-0074837-1: IEC 61010-1 Hot Surface Warning; SymbolCreator: a0412235; Lib Reference: IEC_HotSurface; SymbolVersion: 2011-08-22; Published: 2009-03-03; Publisher: Texas Instruments; LatestRevisionDate: 2017-07-06; PartNumber: CAUTION HOT SURFACE; Library Reference: IEC_HotSurface
LOGO4 = CMP-0074835-1: IEC 61010-1 High Voltage Warning; SymbolCreator: a0412235; Lib Reference: IEC_HighVoltage; SymbolVersion: 2011-08-22; Published: 2009-03-03; Publisher: Texas Instruments; LatestRevisionDate: 2017-07-06; PartNumber: DANGER HIGH VOLTAGE; Library Reference: IEC_HighVoltage
Logo5 = CMP-0074844-1: SymbolCreator: a0412235; Published: 2009-03-03; Publisher: Texas Instruments; LatestRevisionDate: 2017-07-06; Lib Reference: CE Mark; PartNumber: CE Mark; Library Reference: CE Mark
MP5-MP13 = CMP-0040203-1: Round Spacer Unthreaded Steel 0.059" (1.50mm); Manufacturer: Wurth Electronics; AEC Qualified: No; Is Female: yes; SizeZ_mm: 1.6mm; PackageReference: ROUND_SPACER_6MM0; PartNumber: 9774015960R; RoHS: TRUE; Supplier 1: Digikey; Supplier 2: Mouser; Supplier Part Number 1: 732-7071-1-ND; Supplier Part Number 2: 710-9774015960R; Part Number: 9774015960R; datasheet: https://www.we-online.com/components/products/datasheet/9774015960R.pdf; Datasheet Path: datasheets/UNK-9774015960R.pdf; Digikey Description: ROUND SPACER STEEL 1.5MM; Digikey Part Number: 732-7071-1-ND; helpURL: https://upverter.com/upn/revision/67a23d837871b5d5/; Lead Free: Yes; Mouser Description: Spacer Material: Steel Mounting: SMT Series: WA-SMST For ø: 3.3 mm; Mouser Part Number: 710-9774015960R; Operating Temperature Range: -55°C to +150°C; ComponentLink1Description: Datasheet; ComponentLink1URL: https://www.we-online.com/components/products/datasheet/9774015960R.pdf
Q5 = CMP-0000888-1: MOSFET, N-CH, 70 V, 3.8 A, AEC-Q101, SOT-223; Alternate Manufacturer: None; Manufacturer: Diodes Inc.; SizeZ_mm: 1.6; ChType: N; Value2: 7.4 nC; Value1: 0.1; VdsMax_V: 70V; SizeX_mm: 6.5; SizeY_mm: 7; Vgs_V: 20V; AEC Qualified: Y; Value: 70V; Rdson45_ohm: 0.19; SizeArea_mm2: 45.5; AEC Category: Q101; IdsMax_A: 3.8A; SizeAreaWB_mm2: 76.5; U/M: EA; QgTyp_nC: 7.4; Supplier 2: Mouser; Supplier 1: Digi-Key; Supplier Part Number 1: ZXMN7A11GCT-ND; Supplier Part Number 2: 522-ZXMN7A11GTA; PartNumber: ZXMN7A11GTA; ComponentLink1Description: Datasheet link; LatestRevisionDate: 2017-03-09; ComponentLink1URL: http://www.diodes.com/datasheets/ZXMN7A11G.pdf; CompType: MOSFET; PackageReference: SOT-223; LatestRevisionNote: Added parts.; Publisher: Texas Instruments; Published: 2008-06-19; RoHS: Y; MountType: SMT
R118 R119 R126 = CMP-0097027-1: 3 kA Varistor 1 Circuit Through Hole Disc 13.2mm; Manufacturer: Bourns; VDC_V: 350V; Vc: 50A; Cap_F: 30pF; AEC Qualified: No; Clamping Voltage: 730V; SizeZ_mm: 19mm; PackageReference: RADIAL; Datasheet Path: datasheets/Res-IsoM3-275-B-L2.pdf; datasheet: https://www.bourns.com/docs/product-datasheets/isomov.pdf; Operating Temperature Range: -40°C to +125°C; Digikey Part Number: 118-ISOM3-275-B-L2-ND; helpURL: https://upverter.com/upn/revision/432fc44c5de15415/; PartNumber: IsoM3-275-B-L2; ValueDisplayed: 30pF; Part Number: IsoM3-275-B-L2; Mouser Part Number: 652-ISOM3-275-B-L2; RoHS: TRUE; ComponentLink1URL: https://www.bourns.com/docs/product-datasheets/isomov.pdf; Digikey Description: ISOMOV 3KA 275VRMS BULK IN-LINE; Lead Free: Yes; ComponentLink1Description: Datasheet
R120 = CMP-0018816-2: RES, 680 k, 0.1%, 1 W, 1206; Manufacturer: Vishay Draloric; Power_W: 1W; TempCo: 25 ppm/C; U/M: EA; Value: 680k; SizeX_mm: 3.2; SizeY_mm: 1.6; SizeZ_mm: 0.65; SizeArea_mm2: 5.12; AEC Qualified: N; VDC_V: 700V; AEC Category: Q200; Supplier Part Number 2: 46Y8555; Publisher: Texas Instruments; Supplier 2: Newark; Supplier Part Number 3: 71-TNPV1206680KBEEN; Supplier 3: Mouser; Published: 2008-06-26; Value_Code: 680k; RoHS: Y; Value1: 0.1%; MountType: SMT; Supplier 1: Digi-Key; PackageReference: 1206; Tolerance_%: 0.1%; Res_ohm: 680k; Value2: 1W; CompType: Resistor; LatestRevisionDate: 2017-03-09; PartNumber: TNPV1206680KBEEN; ComponentLink1Description: Datasheet link; AEC Grade: N/A; Supplier Part Number 1: 541-2317-1-ND; Technology: Thin Film; ComponentLink1URL: http://www.vishay.com/docs/28881/tnpve3.pdf
R121 R130 = CMP-0018815-2: RES, 560 k, 0.1%, 1 W, 1206; Manufacturer: Vishay Draloric; Power_W: 1W; TempCo: 25 ppm/C; U/M: EA; Value: 560k; SizeX_mm: 3.2; SizeY_mm: 1.6; SizeZ_mm: 0.65; SizeArea_mm2: 5.12; AEC Qualified: N; VDC_V: 700V; AEC Category: Q200; Supplier Part Number 2: 46Y8554; Publisher: Texas Instruments; Supplier 2: Newark; Supplier Part Number 3: 71-TNPV1206560KBEEN; Supplier 3: Mouser; Published: 2008-06-26; Value_Code: 560k; RoHS: Y; Value1: 0.1%; MountType: SMT; Supplier 1: Digi-Key; PackageReference: 1206; Tolerance_%: 0.1%; Res_ohm: 560k; Value2: 1W; CompType: Resistor; LatestRevisionDate: 2017-03-09; PartNumber: TNPV1206560KBEEN; ComponentLink1Description: Datasheet link; AEC Grade: N/A; Supplier Part Number 1: 541-2316-1-ND; Technology: Thin Film; ComponentLink1URL: http://www.vishay.com/docs/28881/tnpve3.pdf
R122-R124 R127-R129 R131-R133 = CMP-0018656-3: RES, 330 k, 5%, 0.25 W, AEC-Q200 Grade 0, 1206; Manufacturer: Vishay-Dale; Power_W: 250mW; TempCo: 200 ppm/C; Value: 330k; EIA_Code: E24; SizeX_mm: 3.2; SizeY_mm: 1.6; SizeZ_mm: 1.35; Value2: 0.25W; SizeArea_mm2: 5.12; AEC Qualified: Y; VDC_V: 200V; AEC Category: Q200; AEC Grade: 0; Supplier Part Number 2: 89M6875; Supplier 2: Newark; Supplier Part Number 3: 71-CRCW1206J-330K-E3; Supplier 3: Mouser; Value_Code: 330k; RoHS: E; Value1: 5%; MountType: SMT; Supplier 1: Digi-Key; PackageReference: 1206; Tolerance_%: 5%; Res_ohm: 330k; CompType: Resistor; PartNumber: CRCW1206330KJNEA; ComponentLink1Description: Datasheet link; Supplier Part Number 1: 541-330KECT-ND; Technology: Thick Film; ComponentLink1URL: http://www.vishay.com/docs/20035/dcrcwe3.pdf
R125 R140 = CMP-0078822-1: RES, 0.002, 1%, 1 W, AEC-Q200 Grade 0, 1206; Manufacturer: Bourns; Value_Code: 2L000; SizeArea_mm2: 5.12; AEC Qualified: Y; AEC Category: Q200; Res_ohm: 2m; Value: 0.002; SizeZ_mm: 1.35; TempCo: 50 ppm/C; AEC Grade: 0; SizeY_mm: 1.6; Power_W: 1W; SizeX_mm: 3.2; ComponentLink1Description: Datasheet link; RoHS: Y; Supplier Part Number 3: 652-CRF1206FZR002ELF; Tolerance_%: 1%; Supplier 1: Digi-Key; PackageReference: 1206; Technology: Metal Film; PartNumber: CRF1206-FZ-R002ELF; Supplier Part Number 2: 13AC4961; Supplier 2: Newark; Value2: 1W; ComponentLink1URL: http://www.bourns.com/docs/Product-Datasheets/crf.pdf; Value1: 1%; CompType: Resistor; MountType: SMT; Supplier Part Number 1: CRF1206-FZ-R002ELFCT-ND; Supplier 3: Mouser
R134-R137 = CMP-0097198-1: 1 MOhms ±0.1% 0.25W, 1/4W Chip Resistor 1206 (3216 Metric) Anti-Sulfur, Automotive AEC-Q200, High Voltage Thin Film; Manufacturer: Susumu; AEC Qualified: Yes; VDC_V: 700V; Power_W: 250mW; TempCo: 25ppm/°C; AEC Grade: Grade 0; Value: 1M; SizeZ_mm: 0.55mm; Digikey Description: RES 1M OHM 0.1% 1/4W 1206; Datasheet Path: datasheets/Res-RGV3216P-1004-B-T1.pdf; Operating Temperature Range: -55°C to +155°C; ComponentLink1URL: https://www.susumu.co.jp/common/pdf/n_catalog_partition39_en.pdf; Tolerance_%: 0.1%; PartNumber: RGV3216P-1004-B-T1; Lead Free: Yes; RoHS: TRUE; Series: RGV; Supplier Part Number 2: 754-RGV3216P-1004BT1; Digikey Part Number: 408-RGV3216P-1004-B-T1CT-ND; Mouser Part Number: 754-RGV3216P-1004BT1; helpURL: https://upverter.com/upn/revision/67a8254e7f59d48f/; Part Number: RGV3216P-1004-B-T1; Supplier 1: Digikey; PackageReference: 1206; Supplier 2: Mouser; datasheet: https://www.susumu.co.jp/common/pdf/n_catalog_partition39_en.pdf; ComponentLink1Description: Datasheet; Supplier Part Number 1: 408-RGV3216P-1004-B-T1CT-ND; Technology: Thin Film
R138 = CMP-0023607-3: RES, 8.20 k, 0.1%, 0.1 W, 0603; Manufacturer: Susumu Co Ltd; Power_W: 100mW; TempCo: 25 ppm/C; Value_Code: 8k20; U/M: EA; Value: 8.20k; Res_ohm: 8.2k; SizeX_mm: 1.6; SizeY_mm: 0.8; SizeZ_mm: 1; Value2: 0.1W; SizeArea_mm2: 1.28; VDC_V: 75V; AEC Category: Q200; Supplier Part Number 2: 754-RG1608P-822-BT5; Publisher: Texas Instruments; Supplier 2: Mouser; Published: 2008-06-26; RoHS: Y; Value1: 0.1%; MountType: SMT; Supplier 1: Digi-Key; PackageReference: 0603; Tolerance_%: 0.1%; CompType: Resistor; LatestRevisionDate: 2017-03-09; PartNumber: RG1608P-822-B-T5; AEC Qualified: ?; ComponentLink1Description: Datasheet link; Supplier Part Number 1: RG16P8.2KBCT-ND; Technology: Metal Film; ComponentLink1URL: http://www.susumu.co.jp/english/pdf/products-j01-01.pdf
R139 = CMP-0023404-3: RES, 10.0 k, 0.1%, 0.1 W, 0603; Manufacturer: Susumu Co Ltd; Power_W: 100mW; TempCo: 25 ppm/C; Value_Code: 10k0; U/M: EA; Value: 10.0k; EIA_Code: E192; Res_ohm: 10k; SizeX_mm: 1.6; SizeY_mm: 0.8; SizeZ_mm: 1; Value2: 0.1W; SizeArea_mm2: 1.28; VDC_V: 75V; AEC Category: Q200; Supplier Part Number 2: 754-RG1608P-103-B-T5; Publisher: Texas Instruments; Supplier 2: Mouser; Supplier Part Number 3: 1797079; Supplier 3: Farnell; Published: 2008-06-26; RoHS: Y; Value1: 0.1%; MountType: SMT; Supplier 1: Digi-Key; PackageReference: 0603; Tolerance_%: 0.1%; CompType: Resistor; LatestRevisionDate: 2017-03-09; PartNumber: RG1608P-103-B-T5; AEC Qualified: ?; ComponentLink1Description: Datasheet link; Supplier Part Number 1: RG16P10.0KBCT-ND; Technology: Metal Film; ComponentLink1URL: http://www.susumu.co.jp/english/pdf/products-j01-01.pdf
R141-R144 = CMP-0023661-3: RES, 10.0, 0.1%, 0.1 W, 0603; Manufacturer: Yageo America; Power_W: 100mW; TempCo: 25 ppm/C; Value_Code: 10R0; U/M: EA; Value: 10.0; EIA_Code: E192; Res_ohm: 10; SizeX_mm: 1.6; SizeY_mm: 0.8; SizeZ_mm: 1; Value2: 0.1W; SizeArea_mm2: 1.28; VDC_V: 75V; AEC Category: Q200; Publisher: Texas Instruments; Published: 2008-06-26; RoHS: Y; Value1: 0.1%; MountType: SMT; PackageReference: 0603; CompType: Resistor; LatestRevisionDate: 2017-03-09; PartNumber: RT0603BRD0710RL; AEC Qualified: ?; ComponentLink1Description: Datasheet link; Technology: Thin Film; ComponentLink1URL: http://www.yageo.com/pdf/PYu-RT_1-to-0.05_RoHS_L_3.pdf
R145 R147 R152 R153 R157 R175-R179 = CMP-0021998-4: RES, 10.0 k, 1%, 0.1 W, AEC-Q200 Grade 0, 0603; Manufacturer: Vishay-Dale; Power_W: 100mW; TempCo: 100 ppm/C; Value_Code: 10k0; Value: 10.0k; EIA_Code: E96; Res_ohm: 10k; SizeX_mm: 1.6; SizeY_mm: 0.8; SizeZ_mm: 1; Value2: 0.1W; SizeArea_mm2: 1.28; AEC Qualified: Y; VDC_V: 75V; AEC Category: Q200; AEC Grade: 0; Supplier Part Number 2: 52K8062; Supplier 2: Newark; Supplier Part Number 3: 71-CRCW0603-10K-E3; Supplier 3: Mouser; RoHS: E; Value1: 1%; MountType: SMT; Supplier 1: Digi-Key; PackageReference: 0603; Tolerance_%: 1%; CompType: Resistor; PartNumber: CRCW060310K0FKEA; ComponentLink1Description: Datasheet link; Supplier Part Number 1: 541-10.0KHCT-ND; Technology: Thick Film; ComponentLink1URL: http://www.vishay.com/docs/20035/dcrcwe3.pdf
R146 = CMP-0097004-1: PTCEL Series 500 V 60 Ohm ±30 % Radial Inrush Current Limiter PTC Thermistor; Manufacturer: Vishay Bccomponents; Value: 60Ω; SizeZ_mm: 17mm; AEC Qualified: Yes; Hold Current: 120mA; Tolerance_%: 30%; VDC_V: 500V; AEC Grade: Grade 2; ComponentLink1URL: https://www.vishay.com/docs/29165/ptcel.pdf; Res_ohm: 60Ω; RoHS: TRUE; Lead Free: Yes; Digikey Part Number: BC3317-ND; Mouser Part Number: 594-PTCEL13R600LBE; Series: PTCEL; ComponentLink1Description: Datasheet; Operating Temperature Range: -40°C to +105°C; helpURL: https://upverter.com/upn/revision/a41b570dcde4aa83/; Part Number: PTCEL13R600LBE; PackageReference: RADIAL; Digikey Description: ICL 60 OHM 13MM; datasheet: https://www.vishay.com/docs/29165/ptcel.pdf; Datasheet Path: datasheets/Res-PTCEL13R600LBE.pdf; PartNumber: PTCEL13R600LBE
R148 R150 R151 R154-R156 R158-R174 R180-R182 = CMP-0023188-5: RES, 56.0, 1%, 0.1 W, 0603; Manufacturer: Yageo; Power_W: 100mW; TempCo: 100 ppm/C; Value_Code: 56R0; Value: 56.0; Res_ohm: 56; SizeX_mm: 1.6; SizeY_mm: 0.8; SizeZ_mm: 1; Value2: 0.1W; SizeArea_mm2: 1.28; AEC Qualified: N; VDC_V: 75V; AEC Category: Q200; SizeAreaWB_mm2: 4.68; Supplier Part Number 2: 603-RC0603FR-0756RL; Supplier 2: Mouser; Supplier Part Number 3: 9238336; Supplier 3: Farnell; RoHS: Y; Value1: 1%; MountType: SMT; Supplier 1: Digi-Key; PackageReference: 0603; Tolerance_%: 1%; CompType: Resistor; PartNumber: RC0603FR-0756RL; ComponentLink1Description: Datasheet link; Supplier Part Number 1: 311-56.0HRCT-ND; Technology: Thick Film; ComponentLink1URL: http://www.yageo.com/pdf/Pu-RC0603_51_PbFree_L_2.pdf; AEC Grade: N/A
R149 = CMP-0023133-5: RES, 47.0 k, 1%, 0.1 W, 0603; Manufacturer: Yageo; Power_W: 100mW; TempCo: 100 ppm/C; Value_Code: 47k0; Value: 47.0k; Res_ohm: 47k; SizeX_mm: 1.6; SizeY_mm: 0.8; SizeZ_mm: 1; Value2: 0.1W; SizeArea_mm2: 1.28; AEC Qualified: N; VDC_V: 75V; AEC Category: Q200; SizeAreaWB_mm2: 4.68; Supplier Part Number 2: 603-RC0603FR-0747KL; Supplier 2: Mouser; Supplier Part Number 3: 9238689; Supplier 3: Farnell; RoHS: Y; Value1: 1%; MountType: SMT; Supplier 1: Digi-Key; PackageReference: 0603; Tolerance_%: 1%; CompType: Resistor; PartNumber: RC0603FR-0747KL; ComponentLink1Description: Datasheet link; Supplier Part Number 1: 311-47.0KHRCT-ND; Technology: Thick Film; ComponentLink1URL: http://www.yageo.com/pdf/Pu-RC0603_51_PbFree_L_2.pdf; AEC Grade: N/A
TP31-TP37 TP39 TP40 TP43 TP44 TP57-TP62 TP64-TP69 = CMP-0055138-2: Test Point, Miniature, Black, TH; Manufacturer: Keystone Electronics; ContactFinish: Silver; CNHeader: FALSE; Green_Lifecycle: Active; Green_REACh: Passed; CT: TRUE; Color: Black; PackageReference: Black Miniature Testpoint; LatestRevisionDate: 26/05/2017; MountType: TH; Publisher: Texas Instruments; Green_EU RoHS-2: Incomplete; PartNumber: 5001; Supplier 1: Digi-Key; Supplier Part Number 1: 36-5001-ND; ComponentLink1URL: http://www.keyelco.com/userAssets/file/M60-2p60.pdf; ComponentLink1Description: Datasheet URL; RoHS: Y; Supplier 2: Mouser; Green_EU RoHS: Passed; CompType: Test Point; Supplier Part Number 2: 534-5001
TP38 = CMP-0055139-2: Test Point, Miniature, White, TH; Manufacturer: Keystone Electronics; ContactFinish: Silver; Green_REACh: Passed; CT: TRUE; Green_Lifecycle: Active; CNHeader: FALSE; Green_EU RoHS: Passed; Green_EU RoHS-2: Passed; Supplier Part Number 3: 534-5002; ComponentLink1URL: http://www.keyelco.com/userAssets/file/M60-2p60.pdf; ComponentLink1Description: Datasheet URL; PackageReference: White Miniature Testpoint; Supplier Part Number 2: 82H9632; MountType: TH; RoHS: Y; CompType: Test Point; LatestRevisionDate: 26/05/2017; Supplier 2: Newark; Supplier 3: Mouser; Supplier Part Number 1: 36-5002-ND; Color: White; Publisher: Texas Instruments; PartNumber: 5002; Supplier 1: Digi-Key
TP41 = CMP-0055141-2: Test Point, Miniature, Yellow, TH; Manufacturer: Keystone Electronics; CT: TRUE; ContactFinish: Silver; Green_Lifecycle: Active; CNHeader: FALSE; Green_REACh: Passed; Supplier 2: Mouser; RoHS: Y; Publisher: Texas Instruments; PackageReference: Yellow Miniature Testpoint; CompType: Test Point; Green_EU RoHS: Passed; Color: Yellow; PartNumber: 5004; Green_EU RoHS-2: Incomplete; LatestRevisionDate: 26/05/2017; Supplier 1: Digi-Key; Supplier Part Number 1: 36-5004-ND; Supplier Part Number 2: 534-5004; MountType: TH; ComponentLink1URL: http://www.keyelco.com/userAssets/file/M60-2p60.pdf; ComponentLink1Description: Datasheet URL
TP42 = CMP-0055140-2: Test Point, Miniature, Orange, TH; Manufacturer: Keystone Electronics; Green_Lifecycle: Active; ContactFinish: Silver; CNHeader: FALSE; CT: TRUE; Green_REACh: Passed; Green_EU RoHS-2: Incomplete; MountType: TH; ComponentLink1URL: http://www.keyelco.com/userAssets/file/M60-2p60.pdf; ComponentLink1Description: Datasheet URL; Supplier 2: Mouser; Supplier Part Number 2: 534-5003; CompType: Test Point; LatestRevisionDate: 26/05/2017; RoHS: Y; Supplier 1: Digi-Key; PartNumber: 5003; Color: Orange; PackageReference: Orange Miniature Testpoint; Publisher: Texas Instruments; Supplier Part Number 1: 36-5003-ND; Green_EU RoHS: Passed
TP45-TP47 TP73 TP74 = CMP-0003968-1: Test Point, SMT; Manufacturer: Harwin; ComponentLink1URL: https://cdn.harwin.com/pdfs/S2751R.pdf; Key: S2751-46R; Publisher: Texas Instruments; Supplier Part Number 2: 76Y5390; Supplier 3: Mouser; Supplier 1: Digi-Key; CompType: Test Point; PackageReference: Test Point, SMT; LatestRevisionDate: 2017-03-09; RoHS: Y; Supplier Part Number 1: 952-2664-1-ND; Supplier Part Number 3: 855-S2751-46R; Supplier 2: Newark; MountType: SMT; PartNumber: S2751-46R; ComponentLink1Description: Datasheet Link
TP56 = CMP-0055137-2: Test Point, Miniature, Red, TH; Manufacturer: Keystone Electronics; Green_REACh: Passed; Green_Lifecycle: Active; ContactFinish: Silver; CNHeader: FALSE; CT: TRUE; Green_EU RoHS-2: Incomplete; Supplier 2: Mouser; PackageReference: Red Miniature Testpoint; MountType: TH; PartNumber: 5000; LatestRevisionDate: 26/05/2017; RoHS: Y; Publisher: Texas Instruments; ComponentLink1URL: http://www.keyelco.com/userAssets/file/M60-2p60.pdf; ComponentLink1Description: Datasheet URL; CompType: Test Point; Supplier Part Number 1: 36-5000-ND; Supplier 1: Digi-Key; Green_EU RoHS: Passed; Color: Red; Supplier Part Number 2: 534-5000
U28 = CMP-0090627-1: Precision, ±1-V Input, Reinforced Isolated Amplifier With Integrated DC/DC Converter; Manufacturer: Texas Instruments; Bandwidth: 310kHz; Max Supply Voltage: 5.5V; SizeZ_mm: 2.65mm; TaMax_C: +125°C; Min Supply Voltage: 3V; TaMin_C: -40°C; TJmax_C: +150°C; Nominal Supply Current: 27.5-28.5mA; AEC Grade: Grade 1; AEC Qualified: Yes; Number Of Channels: 1; Standoff Height: 0.1mm; Input Bias Current: 0.01uA; PackageReference: SOIC16; ComponentLink1Description: Datasheet; Operating Temperature Range: -40°C to +125°C; datasheet: https://www.ti.com/lit/gpn/amc3330-q1; helpURL: https://upverter.com/upn/revision/3f6b3b6b452970d2/; RoHS: TRUE; ComponentLink1URL: https://www.ti.com/lit/gpn/amc3330-q1; Lead Free: Yes; Part Number: AMC3330QDWERQ1; PartNumber: AMC3330QDWERQ1; Datasheet Path: datasheets/IC-AMC3330QDWERQ1.pdf
U29 U31 = CMP-0080671-1: Precision Reinforced Isolated Amplifier for Current Sensing, DWV0008A (SOIC-8); Alternate PartNumber: AMC1302DWVR; Alternate Manufacturer: Texas Instruments; SizeAreaWB_mm2: 105.975; SizeZ_mm: 2.8; SizeX_mm: 11.5; SizeY_mm: 5.85; SizeArea_mm2: 67.275; CompType: IC; AEC Qualified: N; AEC Category: Q200; ComponentLink1URL: http://www.ti.com/lit/ds/symlink/amc1302.pdf; PackageDescription: SOIC-8; MountType: SMT; ComponentLink2URL: http://www.ti.com/product/amc1302; ComponentLink3Description: Online Datasheet; ComponentLink2Description: Product Folder; Manufacturer: Texas Instruments; ComponentLink3URL: http://www.ti.com/product/amc1302/datasheet; PackageReference: DWV0008A; PartNumber: AMC1302DWV; ComponentLink1Description: Datasheet Link
U30 = CMP-0078341-1: Precision, 2-V Input, Reinforced Isolated Amplifier, DWV0008A (SOIC-8); Alternate Manufacturer: Texas Instruments; SizeAreaWB_mm2: 105.975; SizeZ_mm: 2.8; SizeX_mm: 11.5; SizeY_mm: 5.85; SizeArea_mm2: 67.275; CompType: IC; AEC Qualified: N; AEC Category: Q200; ComponentLink1URL: https://sps16.itg.ti.com/sites/KMS/crossdivteams/altium/docs/ComponentDatasheets/AMC1311%20preliminarySBAS786_24May17.pdf; Alternate PartNumber: AMC1311BDWV; PackageDescription: SOIC-8; MountType: SMT; ComponentLink2URL: TBD; ComponentLink2Description: Product Folder; Manufacturer: Texas Instruments; PackageReference: DWV0008A; PartNumber: AMC1311BDWVR; ComponentLink1Description: Datasheet Link
U32 = CMP-0096054-1: Manufacturer: Texas Instruments; Standoff Height: 0.1mm; AEC Qualified: No; SizeZ_mm: 2.65mm; helpURL: https://upverter.com/upn/revision/188549e84019764e/; PackageReference: SOIC10; RoHS: UNKNOWN; Part Number: TMCS1123B4QDVGR; Operating Temperature Range: to; PartNumber: TMCS1123B4QDVGR; Datasheet Path: datasheets/IC-TMCS1123B4QDVGR.pdf
U33 U34 = CMP-0051583-2: Enhanced Product Single 2-Input Positive-And Gate, DBV0005A, LARGE T&R; Generic Part Number: SN74LVC1G08-EP; Manufacturer: Texas Instruments; Bits(#): 1; Logic: True; ICC @ Nom Voltage(Max)(mA): 0.01; Gate Type: AND; Schmitt Trigger: No; Rating: HiRel Enhanced Product; F @ Nom Voltage(Max)(Mhz): 150; Technology Family: LVC; tpd @ Nom Voltage(Max)(ns): 8,5.5,4.5,4; Output Type: CMOS; Output Drive (IOL/IOH)(Max)(mA): 32/-32; VCC(Min)(V): 1.65; Input Type: CMOS/TTL; Voltage(Nom)(V): 1.8,2.5,3.3,5; VCC(Max)(V): 5.5; AEC Category: Q200; AEC Qualified: N; CompType: IC; Sub-Family: AND Gate; 3-State Output: No; Operating Temperature Range(C): -40 to 85,-55 to 125; PackageReference: DBV0005A; DatasheetVersion: SCES454C; Alternate Manufacturer: Texas Instruments; ComponentLink1Description: Datasheet Link; ComponentLink1URL: http://www.ti.com/lit/ds/symlink/SN74LVC1G08-EP.pdf; ComponentLink2Description: Product Folder; ComponentLink2URL: http://www.ti.com/product/SN74LVC1G08-EP; MountType: SMT; PackageDescription: DSBGA-5; PartNumber: SN74LVC1G08MDBVREP; RoHS: Y
U35 = CMP-0051643-2: Single Schmitt-Trigger Inverter, DBV0005A, SMALL T&R; Manufacturer: Texas Instruments; Alternate PartNumber: SN74LVC1G14DBVR; F @ Nom Voltage(Max)(Mhz): 150; Logic: Inverting; Output Drive (IOL/IOH)(Max)(mA): 32/-32; Output Type: CMOS; Bits(#): 1; Technology Family: LVC; Input Type: CMOS/TTL; Schmitt Trigger: Yes; Rating: Catalog; Sub-Family: Inverting Buffer/Driver; tpd @ Nom Voltage(Max)(ns): 11,6.5,5.5,5; VCC(Max)(V): 5.5; 3-State Output: No; ICC @ Nom Voltage(Max)(mA): 0.01; Voltage(Nom)(V): 1.8,2.5,3.3,5; VCC(Min)(V): 1.65; AEC Category: Q200; AEC Qualified: N; CompType: IC; SizeAreaWB_mm2: 14.82; SizeArea_mm2: 8.12; SizeX_mm: 2.8; SizeY_mm: 2.9; SizeZ_mm: 1.45; PackageReference: DBV0005A; DatasheetVersion: SCES218W; Generic Part Number: SN74LVC1G14; Operating Temperature Range(C): -40 to 125,-40 to 85; Alternate Manufacturer: Texas Instruments; ComponentLink1Description: Datasheet Link; ComponentLink1URL: http://www.ti.com/lit/ds/symlink/sn74lvc1g14.pdf; ComponentLink2Description: Product Folder; ComponentLink2URL: http://www.ti.com/product/sn74lvc1g14; ComponentLink3Description: Online Datasheet; ComponentLink3URL: http://www.ti.com/product/sn74lvc1g14/datasheet; MountType: SMT; PackageDescription: SOT-23-5; PartNumber: SN74LVC1G14DBVT; RoHS: Y
ZZ1 = CMP-0077236-1: Key: AssemblyNote; Publisher: Texas Instruments; CompType: AssemblyNote; LatestRevisionDate: 2017-08-10; ClassName: AssemblyNote
ZZ2 = CMP-0077237-1: Key: AssemblyNote; Publisher: Texas Instruments; CompType: AssemblyNote; LatestRevisionDate: 2017-08-10; ClassName: AssemblyNote
ZZ3 = CMP-0077238-1: Key: AssemblyNote; Publisher: Texas Instruments; CompType: AssemblyNote; LatestRevisionDate: 2017-08-10; ClassName: AssemblyNote